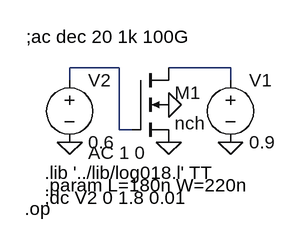
[diagram p0: schematic NCH.asc]
NCH.asc, the LTspice schematic file:
Version 4
SHEET 1 880 680
WIRE -16 128 -80 128
WIRE 128 128 48 128
WIRE -80 144 -80 128
WIRE 128 144 128 128
WIRE -16 208 -16 128
WIRE 0 208 -16 208
FLAG 48 176 0
FLAG 48 224 0
FLAG 128 224 0
FLAG -80 224 0
SYMBOL nmos4 0 128 R0
SYMATTR InstName M1
SYMATTR Value nch
SYMATTR Value2 l={L} w={W} m=1
SYMBOL voltage 128 128 R0
SYMATTR InstName V1
SYMATTR Value 0.9
SYMBOL voltage -80 128 R0
WINDOW 123 24 110 Left 2
WINDOW 39 0 0 Left 0
SYMATTR Value2 AC 1 0
SYMATTR InstName V2
SYMATTR Value 0.6
TEXT -112 264 Left 2 !.lib '../lib/log018.l' TT
TEXT -112 280 Left 2 !.param L=180n W=220n
TEXT -112 296 Left 2 !;dc V2 0 1.8 0.01
TEXT -136 88 Left 2 !;ac dec 20 1k 100G
TEXT -138 310 Left 2 !.op

The netlist it stands for:
* NCH.asc
M1 N002 N001 0 0 nch l={L} w={W} m=1
V1 N002 0 0.9
V2 N001 0 0.6 AC 1 0
.model NMOS NMOS
.model PMOS PMOS
.lib standard.mos
.lib '../lib/log018.l' TT
.param L=180n W=220n
;dc V2 0 1.8 0.01
;ac dec 20 1k 100G
.op
.backanno
.end